# EAGLE schematic battery_boost_converter_TPS61200 (EAGLE 6.1)
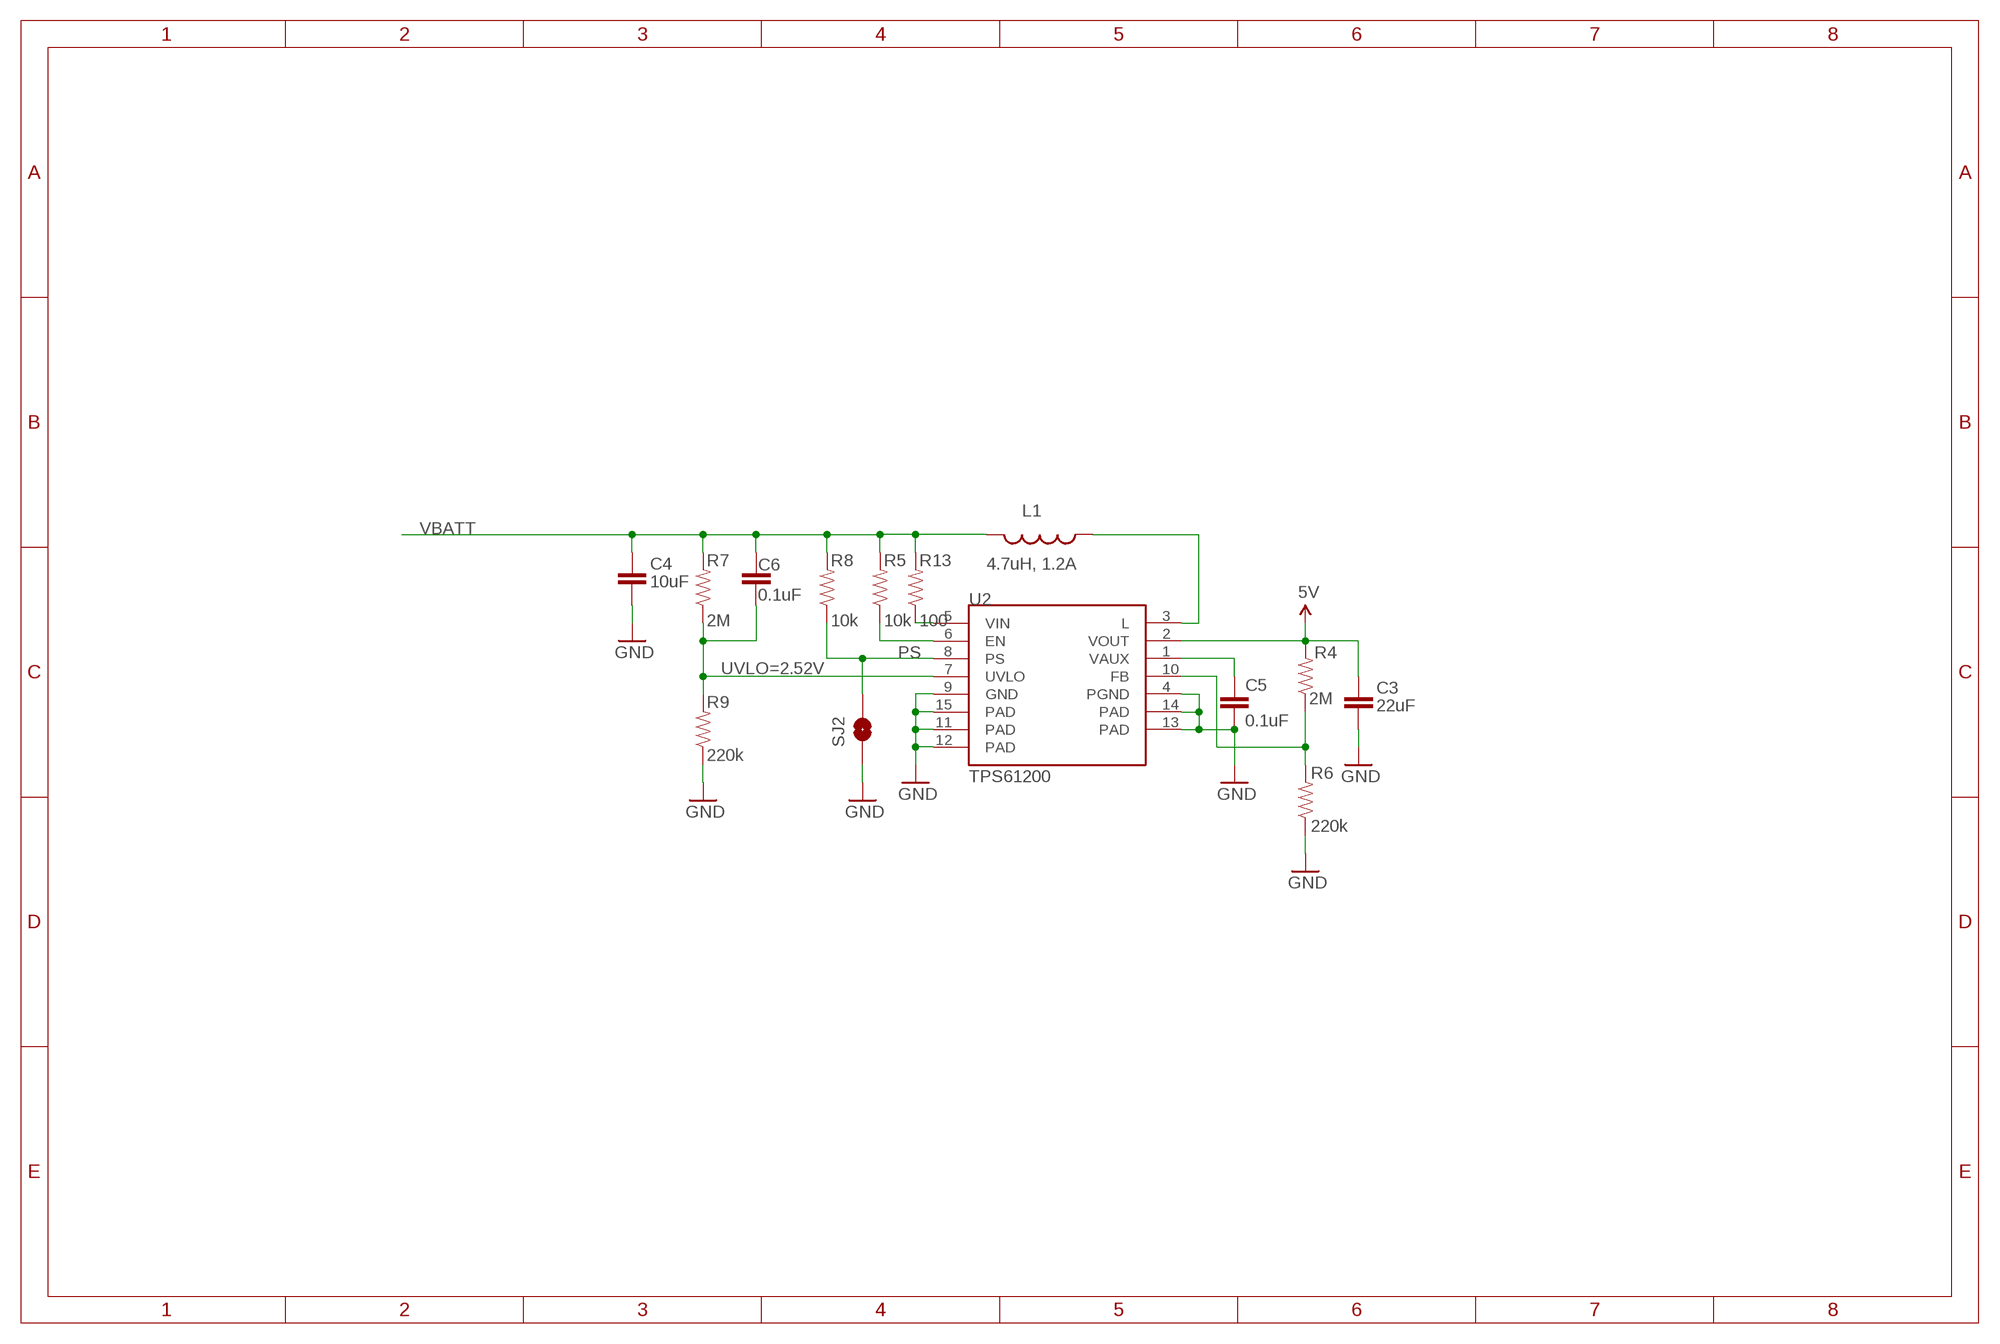
[diagram p0: schematic, sheet 1]

## Parts
C3  22uF  CAP0805  [0805]
C4  10uF  CAP1206  [1206]
C5  0.1uF  CAP0402-CAP  [0402-CAP]
C6  0.1uF  CAP0402-CAP  [0402-CAP]
L1  4.7uH, 1.2A  INDUCTOR.  [CDRH2D09]
R4  2M  RESISTOR0402-RES  [0402-RES]
R5  10k  RESISTOR0402-RES  [0402-RES]
R6  220k  RESISTOR0402-RES  [0402-RES]
R7  2M  RESISTOR0402-RES  [0402-RES]
R8  10k  RESISTOR0402-RES  [0402-RES]
R9  220k  RESISTOR0402-RES  [0402-RES]
R13  100  RESISTOR0402-RES  [0402-RES]
SJ2  PS  SOLDERJUMPERNO  [SJ_2S-NO]
U2  TPS61200  [QFN-10_PAD]

## Nets
5V: C3.1 R4.2 U2.2(VOUT)
EN: R5.1 U2.6(EN)
FB: R4.1 R6.2 U2.10(FB)
GND: C3.2 C4.2 C5.2 R6.1 R9.1 SJ2.1 U2.4(PGND) U2.9(GND) U2.11(PAD) U2.12(PAD) U2.13(PAD) U2.14(PAD) U2.15(PAD)
N$3: L1.P$1 U2.3(L)
N$4: C5.1 U2.1(VAUX)
PS: R8.1 SJ2.2 U2.8(PS)
UVLO: C6.2 R7.1 R9.2 U2.7(UVLO)
VBATT: C4.1 C6.1 L1.P$2 R5.2 R7.2 R8.2 R13.2
VIN-L: R13.1 U2.5(VIN)

## Notes on the sheet
- UVLO=2.52V

## Library data of the parts
C3 C4 = CH_passive:CAP: Capacitor Standard 0603 ceramic capacitor, and 0.1" leaded capacitor.
C5 C6 = SparkFun:CAP: Capacitor Standard 0603 ceramic capacitor, and 0.1" leaded capacitor.
L1 = SparkFun:INDUCTOR: Inductors Basic Inductor/Choke - 0603 and 1206. Footprints are not proven and vary greatly between part numbers.
R4-R9 R13 = SparkFun:RESISTOR: Resistor Basic schematic elements and footprints for 0603, 1206, and PTH resistors.
SJ2 = SparkFun:SOLDERJUMPER: Solder Jumper Standard SMD solder jumper. Used to automate production. Two varients : Normally Open and Normally Closed are the same, but have different paste layers. NC will have a large amount of paste and should jumper during reflow.
U2 = SparkFun:TPS61200: DC to DC Booster